# Altium schematic sheet WATCHDOG.SchDoc
size 420 x 297 mm; SheetNumber: 17; SheetTotal: 23
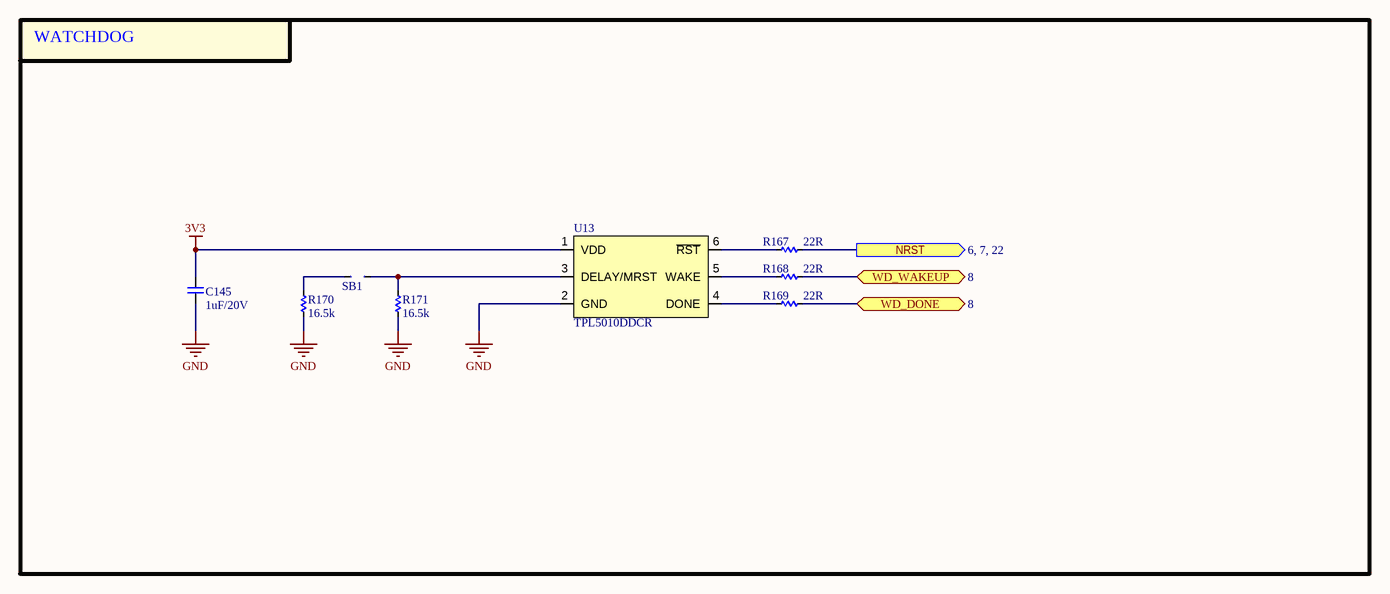
[diagram p0: WATCHDOG.SchDoc]

## Parts
C145  1uF/20V  [CAP_C_1005X50_L]
R167  22R  [RES_C_1005x30_L]
R168  22R  [RES_C_1005x30_L]
R169  22R  [RES_C_1005x30_L]
R170  16.5k  [RES_C_1005x30_L]
R171  16.5k  [RES_C_1005x30_L]
SB1  JUMPER  [JUMPER_1608]  (value not drawn)
U13  TPL5010DDCR  [TPL5010DDCR]

## Blocks framed on the sheet
WATCHDOG: C145 R167-R171 SB1 U13

## Ports
NRST (out, see 6, 7, 22), WD_DONE (bidir, see 8), WD_WAKEUP (bidir, see 8)

## Nets
3V3: C145.2 U13.1(VDD)
GND: C145.1 R170.2 R171.2 U13.2(GND)
NRST: R167.2 ; port NRST
WD_DONE: R169.2 ; port WD_DONE
WD_WAKEUP: R168.2 ; port WD_WAKEUP
NetR167_1: R167.1 U13.6(~{RST})
NetR168_1: R168.1 U13.5(WAKE)
NetR169_1: R169.1 U13.4(DONE)
NetR170_1: R170.1 SB1.1
NetR171_1: R171.1 SB1.2 U13.3(DELAY/MRST)

## Notes on the sheet
- Project:
- BEE-1012
- Sub-system:
- SATELLITE_EXP_CONTROLLER
- Design by:
- SANG HUYNH
- BAO BUI
- Sheet title:
- Sheet
- A3
- of
- Checked by:
- Approved by:
- VU PHAM
- Revision:
- Document No:
- Size:
- Date:

## Library data of the parts
C145 = _CAP_C_2: CAP CHIP
R167-R171 = _RES_B_2: RES
U13 = TPL5010DDCR: OSC PROG TIMER TSOT23-6